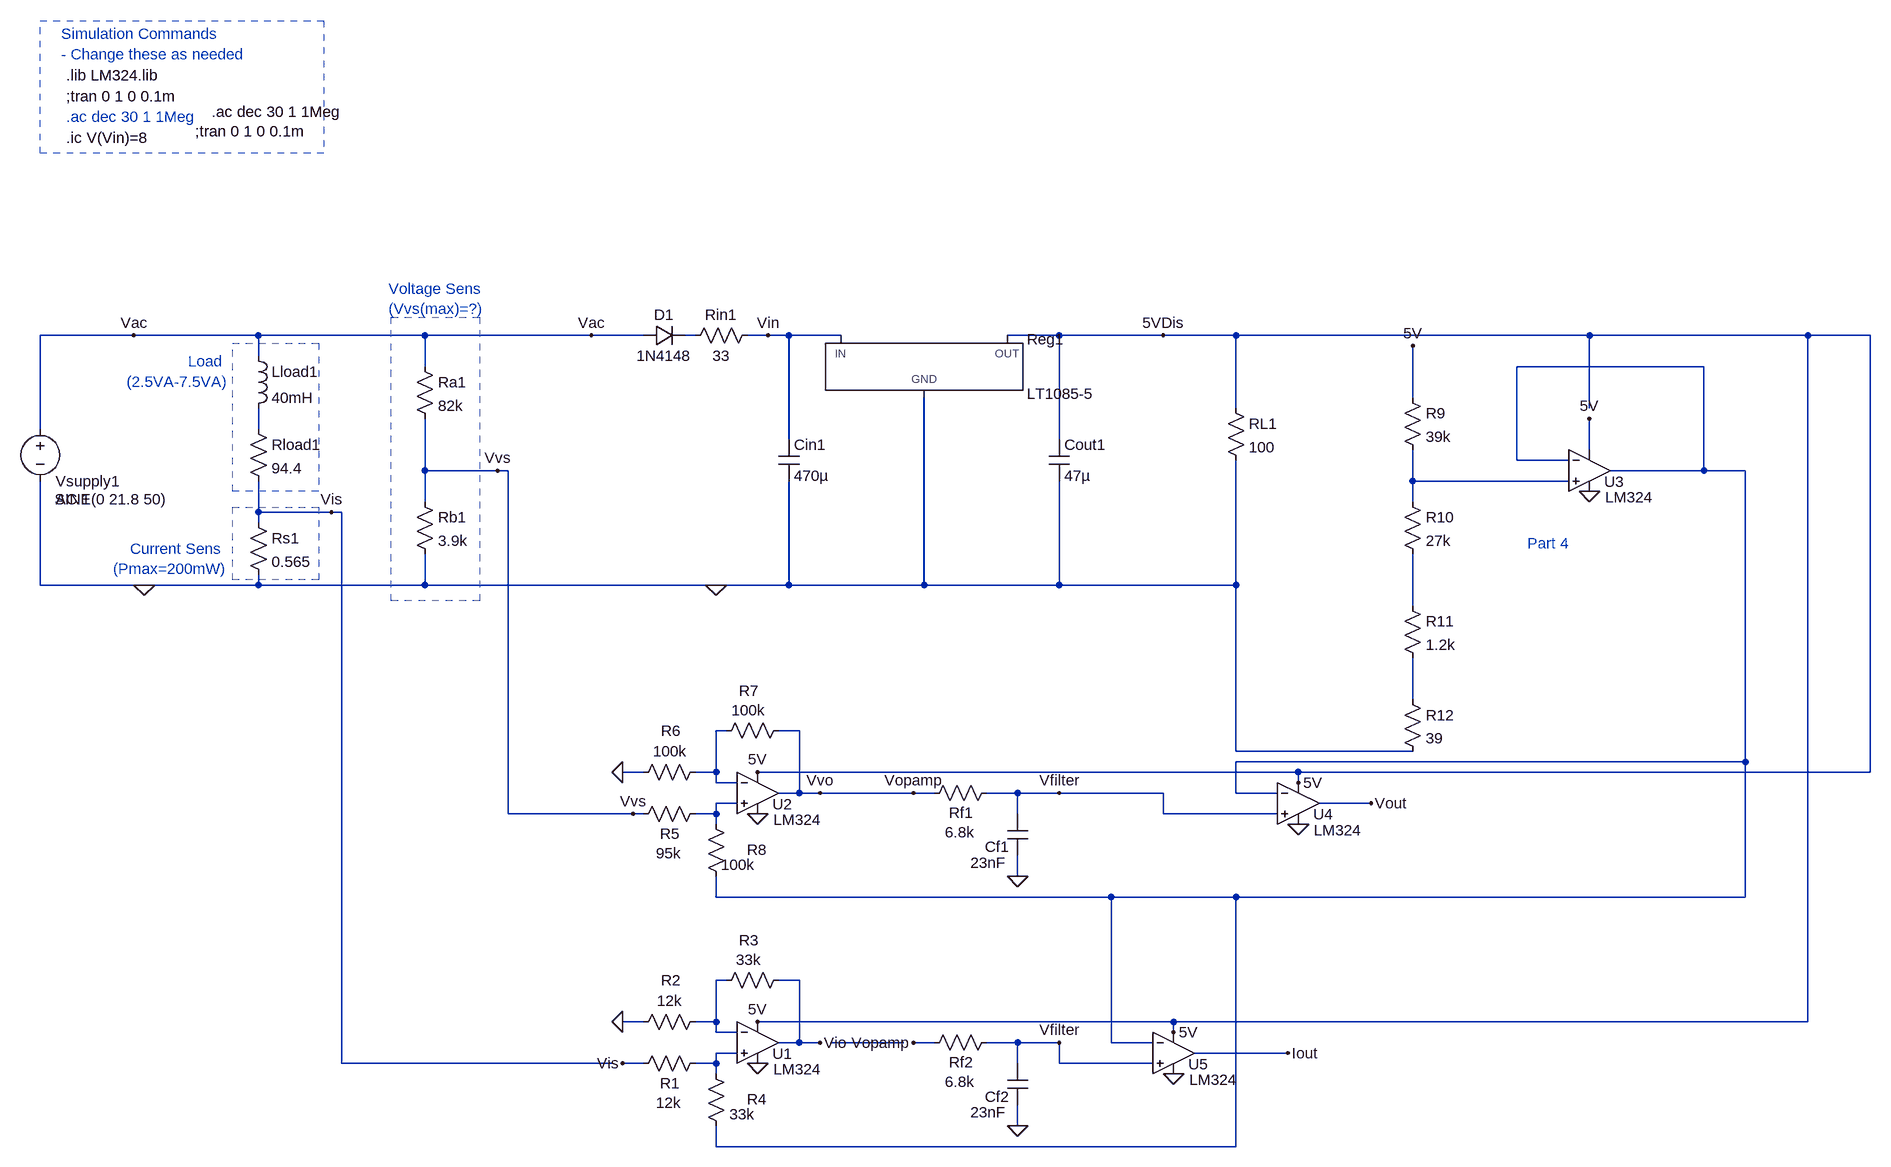
[diagram p0: schematic Final_Implementation.asc]
Final_Implementation.asc, the LTspice schematic file:
Version 4
SHEET 1 2608 1316
WIRE -656 -272 -800 -272
WIRE -464 -272 -656 -272
WIRE -208 -272 -464 -272
WIRE 48 -272 -208 -272
WIRE 128 -272 48 -272
WIRE 208 -272 192 -272
WIRE 320 -272 288 -272
WIRE 352 -272 320 -272
WIRE 432 -272 352 -272
WIRE 768 -272 688 -272
WIRE 928 -272 768 -272
WIRE 1040 -272 928 -272
WIRE 1584 -272 1040 -272
WIRE 1920 -272 1584 -272
WIRE 2016 -272 1920 -272
WIRE -464 -240 -464 -272
WIRE -208 -224 -208 -272
WIRE 1760 -224 1472 -224
WIRE 1312 -176 1312 -256
WIRE 1040 -160 1040 -272
WIRE 1584 -160 1584 -272
WIRE -800 -128 -800 -272
WIRE -464 -128 -464 -160
WIRE 352 -112 352 -272
WIRE 768 -112 768 -272
WIRE 1584 -96 1584 -144
WIRE 1472 -80 1472 -224
WIRE 1552 -80 1472 -80
WIRE -208 -64 -208 -144
WIRE -96 -64 -208 -64
WIRE -80 -64 -96 -64
WIRE 1760 -64 1760 -224
WIRE 1760 -64 1616 -64
WIRE 1824 -64 1760 -64
WIRE 1312 -48 1312 -96
WIRE 1552 -48 1312 -48
WIRE -208 -16 -208 -64
WIRE 1312 -16 1312 -48
WIRE -464 0 -464 -48
WIRE -352 0 -464 0
WIRE -336 0 -352 0
WIRE -464 16 -464 0
WIRE -800 112 -800 -48
WIRE -640 112 -800 112
WIRE -464 112 -464 96
WIRE -464 112 -640 112
WIRE -208 112 -208 64
WIRE -208 112 -464 112
WIRE 240 112 -208 112
WIRE 352 112 352 -48
WIRE 352 112 240 112
WIRE 560 112 560 -176
WIRE 560 112 352 112
WIRE 768 112 768 -48
WIRE 768 112 560 112
WIRE 1040 112 1040 -80
WIRE 1040 112 768 112
WIRE 1312 144 1312 64
WIRE 1312 288 1312 224
WIRE 256 336 240 336
WIRE 368 336 336 336
WIRE 1040 368 1040 112
WIRE 1312 368 1040 368
WIRE 1824 384 1824 -64
WIRE 1824 384 1040 384
WIRE 128 400 96 400
WIRE 240 400 240 336
WIRE 240 400 208 400
WIRE 1136 400 304 400
WIRE 2016 400 2016 -272
WIRE 2016 400 1136 400
WIRE 240 416 240 400
WIRE 272 416 240 416
WIRE 1136 416 1136 400
WIRE 368 432 368 336
WIRE 368 432 336 432
WIRE 400 432 368 432
WIRE 544 432 400 432
WIRE 576 432 544 432
WIRE 704 432 656 432
WIRE 768 432 704 432
WIRE 928 432 768 432
WIRE 1040 432 1040 384
WIRE 1104 432 1040 432
WIRE 272 448 240 448
WIRE 1248 448 1168 448
WIRE -80 464 -80 -64
WIRE 112 464 -80 464
WIRE 128 464 112 464
WIRE 240 464 240 448
WIRE 240 464 208 464
WIRE 704 464 704 432
WIRE 928 464 928 432
WIRE 1104 464 928 464
WIRE 240 480 240 464
WIRE 704 560 704 528
WIRE 240 592 240 560
WIRE 848 592 240 592
WIRE 1040 592 848 592
WIRE 1824 592 1824 384
WIRE 1824 592 1040 592
WIRE 256 720 240 720
WIRE 368 720 336 720
WIRE 128 784 96 784
WIRE 240 784 240 720
WIRE 240 784 208 784
WIRE 944 784 304 784
WIRE 1920 784 1920 -272
WIRE 1920 784 944 784
WIRE 240 800 240 784
WIRE 272 800 240 800
WIRE 944 800 944 784
WIRE 368 816 368 720
WIRE 368 816 336 816
WIRE 400 816 368 816
WIRE 528 816 416 816
WIRE 576 816 544 816
WIRE 704 816 656 816
WIRE 768 816 704 816
WIRE 848 816 848 592
WIRE 912 816 848 816
WIRE 272 832 240 832
WIRE 1120 832 976 832
WIRE -336 848 -336 0
WIRE 80 848 -336 848
WIRE 128 848 96 848
WIRE 240 848 240 832
WIRE 240 848 208 848
WIRE 704 848 704 816
WIRE 768 848 768 816
WIRE 912 848 768 848
WIRE 240 864 240 848
WIRE 704 944 704 912
WIRE 240 976 240 944
WIRE 1040 976 1040 592
WIRE 1040 976 240 976
FLAG -640 112 0
FLAG -656 -272 Vac
FLAG -352 0 Vis
FLAG -96 -64 Vvs
FLAG 304 848 0
FLAG 304 784 5V
FLAG 96 848 Vis
FLAG 96 784 0
FLAG 400 816 Vio
FLAG 304 464 0
FLAG 304 400 5V
FLAG 96 400 0
FLAG 400 432 Vvo
FLAG 704 560 0
FLAG 544 432 Vopamp
FLAG 768 432 Vfilter
FLAG 48 -272 Vac
FLAG 928 -272 5VDis
FLAG 320 -272 Vin
FLAG 1312 -256 5V
FLAG 1584 -32 0
FLAG 1584 -144 5V
FLAG 240 112 0
FLAG 704 944 0
FLAG 544 816 Vopamp
FLAG 768 816 Vfilter
FLAG 112 464 Vvs
FLAG 1136 480 0
FLAG 1136 416 5V
FLAG 944 864 0
FLAG 944 800 5V
FLAG 1248 448 Vout
FLAG 1120 832 Iout
SYMBOL voltage -800 -144 R0
WINDOW 0 24 96 Left 2
WINDOW 3 22 124 Left 2
WINDOW 123 24 124 Left 2
WINDOW 39 0 0 Left 0
SYMATTR InstName Vsupply1
SYMATTR Value SINE(0 21.8 50)
SYMATTR Value2 AC 1
SYMBOL res -480 -144 R0
SYMATTR InstName Rload1
SYMATTR Value 94.4
SYMBOL ind -480 -256 R0
SYMATTR InstName Lload1
SYMATTR Value 40mH
SYMBOL res -480 0 R0
SYMATTR InstName Rs1
SYMATTR Value 0.565
SYMBOL res -224 -240 R0
SYMATTR InstName Ra1
SYMATTR Value 82k
SYMBOL res -224 -32 R0
SYMATTR InstName Rb1
SYMATTR Value 3.9k
SYMBOL Opamps/opamp2 304 752 R0
WINDOW 0 23 81 Left 2
WINDOW 3 24 105 Left 2
SYMATTR InstName U1
SYMATTR Value LM324
SYMBOL res 224 832 R90
WINDOW 0 62 55 VBottom 2
WINDOW 3 61 57 VTop 2
SYMATTR InstName R1
SYMATTR Value 12k
SYMBOL res 224 768 R90
WINDOW 0 -32 53 VBottom 2
WINDOW 3 -32 55 VTop 2
SYMATTR InstName R2
SYMATTR Value 12k
SYMBOL res 352 704 R90
WINDOW 0 -30 61 VBottom 2
WINDOW 3 -31 62 VTop 2
SYMATTR InstName R3
SYMATTR Value 33k
SYMBOL res 256 960 R180
WINDOW 0 -62 57 Left 2
WINDOW 3 -44 34 Left 2
SYMATTR InstName R4
SYMATTR Value 33k
SYMBOL Opamps/opamp2 304 368 R0
WINDOW 0 23 81 Left 2
WINDOW 3 24 105 Left 2
SYMATTR InstName U2
SYMATTR Value LM324
SYMBOL res 224 448 R90
WINDOW 0 62 55 VBottom 2
WINDOW 3 61 57 VTop 2
SYMATTR InstName R5
SYMATTR Value 95k
SYMBOL res 224 384 R90
WINDOW 0 -32 53 VBottom 2
WINDOW 3 -32 55 VTop 2
SYMATTR InstName R6
SYMATTR Value 100k
SYMBOL res 352 320 R90
WINDOW 0 -30 61 VBottom 2
WINDOW 3 -31 62 VTop 2
SYMATTR InstName R7
SYMATTR Value 100k
SYMBOL res 256 576 R180
WINDOW 0 -62 57 Left 2
WINDOW 3 -44 34 Left 2
SYMATTR InstName R8
SYMATTR Value 100k
SYMBOL res 672 416 R90
WINDOW 0 62 55 VBottom 2
WINDOW 3 61 57 VTop 2
SYMATTR InstName Rf1
SYMATTR Value 6.8k
SYMBOL cap 720 528 R180
WINDOW 0 29 13 Left 2
WINDOW 3 33 -11 Left 2
SYMATTR InstName Cf1
SYMATTR Value 23nF
SYMBOL PowerProducts/LT1085-5 560 -272 R0
SYMATTR InstName Reg1
SYMBOL res 1024 -176 R0
SYMATTR InstName RL1
SYMATTR Value 100
SYMBOL res 304 -288 R90
WINDOW 0 0 56 VBottom 2
WINDOW 3 32 56 VTop 2
SYMATTR InstName Rin1
SYMATTR Value 33
SYMBOL diode 128 -256 R270
WINDOW 0 32 32 VTop 2
WINDOW 3 0 32 VBottom 2
SYMATTR InstName D1
SYMATTR Value 1N4148
SYMBOL cap 336 -112 R0
SYMATTR InstName Cin1
SYMATTR Value 470µ
SYMATTR SpiceLine Rser=0.001
SYMBOL cap 752 -112 R0
SYMATTR InstName Cout1
SYMATTR Value 47µ
SYMATTR SpiceLine Rser=0.001
SYMBOL res 1296 -192 R0
SYMATTR InstName R9
SYMATTR Value 39k
SYMBOL res 1296 -32 R0
SYMATTR InstName R10
SYMATTR Value 27k
SYMBOL res 1296 128 R0
SYMATTR InstName R11
SYMATTR Value 1.2k
SYMBOL res 1296 272 R0
SYMATTR InstName R12
SYMATTR Value 39
SYMBOL Opamps/opamp2 1584 -128 R0
WINDOW 0 23 81 Left 2
WINDOW 3 24 105 Left 2
SYMATTR InstName U3
SYMATTR Value LM324
SYMBOL res 672 800 R90
WINDOW 0 62 55 VBottom 2
WINDOW 3 61 57 VTop 2
SYMATTR InstName Rf2
SYMATTR Value 6.8k
SYMBOL cap 720 912 R180
WINDOW 0 29 13 Left 2
WINDOW 3 33 -11 Left 2
SYMATTR InstName Cf2
SYMATTR Value 23nF
SYMBOL Opamps/opamp2 1136 384 R0
WINDOW 0 23 81 Left 2
WINDOW 3 24 105 Left 2
SYMATTR InstName U4
SYMATTR Value LM324
SYMBOL Opamps/opamp2 944 768 R0
WINDOW 0 23 81 Left 2
WINDOW 3 24 105 Left 2
SYMATTR InstName U5
SYMATTR Value LM324
TEXT -512 -232 Right 2 ;Load \n(2.5VA-7.5VA)
TEXT -512 56 Right 2 ;Current Sens \n(Pmax=200mW)
TEXT -264 -344 Left 2 ;Voltage Sens\n(Vvs(max)=?)
TEXT 1488 48 Left 2 ;Part 4
TEXT -760 -608 Left 2 ;.ac dec 30 1 1Meg
TEXT -760 -672 Left 2 !.lib LM324.lib
TEXT -768 -736 Left 2 ;Simulation Commands\n- Change these as needed
TEXT -760 -640 Left 2 !;tran 0 1 0 0.1m
TEXT -760 -576 Left 2 !.ic V(Vin)=8
TEXT -562 -586 Left 2 !;tran 0 1 0 0.1m
TEXT -536 -616 Left 2 !.ac dec 30 1 1Meg
RECTANGLE Normal -260 -300 -124 136 2
RECTANGLE Normal -504 -260 -372 -32 2
RECTANGLE Normal -504 -8 -372 104 2
RECTANGLE Normal -800 -756 -364 -552 2

The netlist it stands for:
* Final_Implementation.asc
Vsupply1 Vac 0 SINE(0 21.8 50) AC 1
Rload1 N003 Vis 94.4
Lload1 Vac N003 40mH
Rs1 Vis 0 0.565
Ra1 Vac Vvs 82k
Rb1 Vvs 0 3.9k
XU1 N011 N009 5VDis 0 Vio LM324  ; pins In+ In- V+ V- OUT
R1 N011 Vis 12k
R2 N009 0 12k
R3 Vio N009 33k
R4 N002 N011 33k
XU2 N008 N007 5VDis 0 Vopamp LM324  ; pins In+ In- V+ V- OUT
R5 N008 Vvs 95k
R6 N007 0 100k
R7 Vopamp N007 100k
R8 N002 N008 100k
Rf1 Vfilter Vopamp 6.8k
Cf1 0 Vfilter 23nF
XReg1 0 5VDis Vin LT1085-5  ; pins GND OUT IN
RL1 5VDis 0 100
Rin1 Vin N001 33
D1 Vac N001 1N4148
Cin1 Vin 0 470µ Rser=0.001
Cout1 5VDis 0 47µ Rser=0.001
R9 5VDis N004 39k
R10 N004 N005 27k
R11 N005 N006 1.2k
R12 N006 0 39
XU3 N004 N002 5VDis 0 N002 LM324  ; pins In+ In- V+ V- OUT
Rf2 Vfilter Vopamp 6.8k
Cf2 0 Vfilter 23nF
XU4 Vfilter N002 5VDis 0 Vout LM324  ; pins In+ In- V+ V- OUT
XU5 Vfilter N002 5VDis 0 Iout LM324  ; pins In+ In- V+ V- OUT
.model D D
.lib standard.dio
* Load
* (2.5VA-7.5VA)
* Current Sens
* (Pmax=200mW)
* Voltage Sens
* (Vvs(max)=?)
* Part 4
* .ac dec 30 1 1Meg
.lib LM324.lib
* Simulation Commands
* - Change these as needed
;tran 0 1 0 0.1m
.ic V(Vin)=8
;tran 0 1 0 0.1m
.ac dec 30 1 1Meg
.backanno
.end